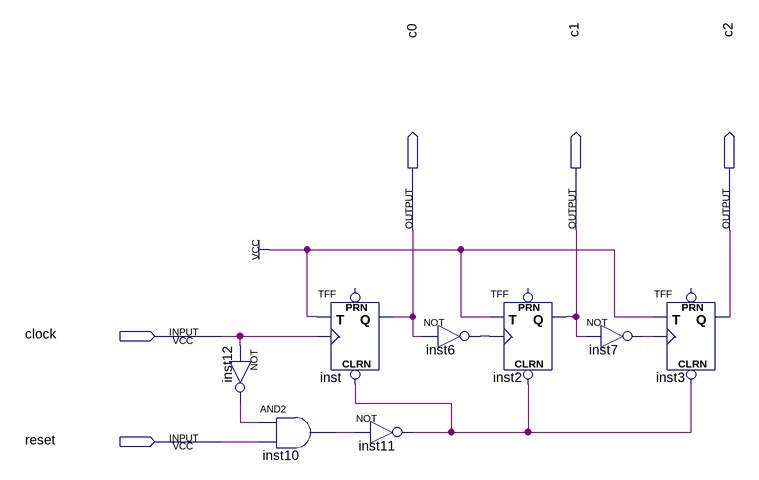
[diagram p0: schematic sheet]
// Quartus schematic Contador.bdf as structural Verilog: 8 symbols, 5 pins
module Contador (
  input  clock,
  input  reset,
  output c0,
  output c1,
  output c2
);

  wire inst6_out, inst7_out, inst10_out, inst11_out, inst12_out;

  not inst12 (inst12_out, clock);
  and inst10 (inst10_out, inst12_out, reset);
  TFF inst (.CLRN(inst11_out), .T(1'b1), .CLK(clock), .Q(c0));  // open: PRN
  not inst11 (inst11_out, inst10_out);
  not inst6 (inst6_out, c0);
  TFF inst2 (.CLRN(inst11_out), .T(1'b1), .CLK(inst6_out), .Q(c1));  // open: PRN
  not inst7 (inst7_out, c1);
  TFF inst3 (.CLRN(inst11_out), .T(1'b1), .CLK(inst7_out), .Q(c2));  // open: PRN
endmodule
